# EasyEDA Pro project 通用采样.eprj, board INA240
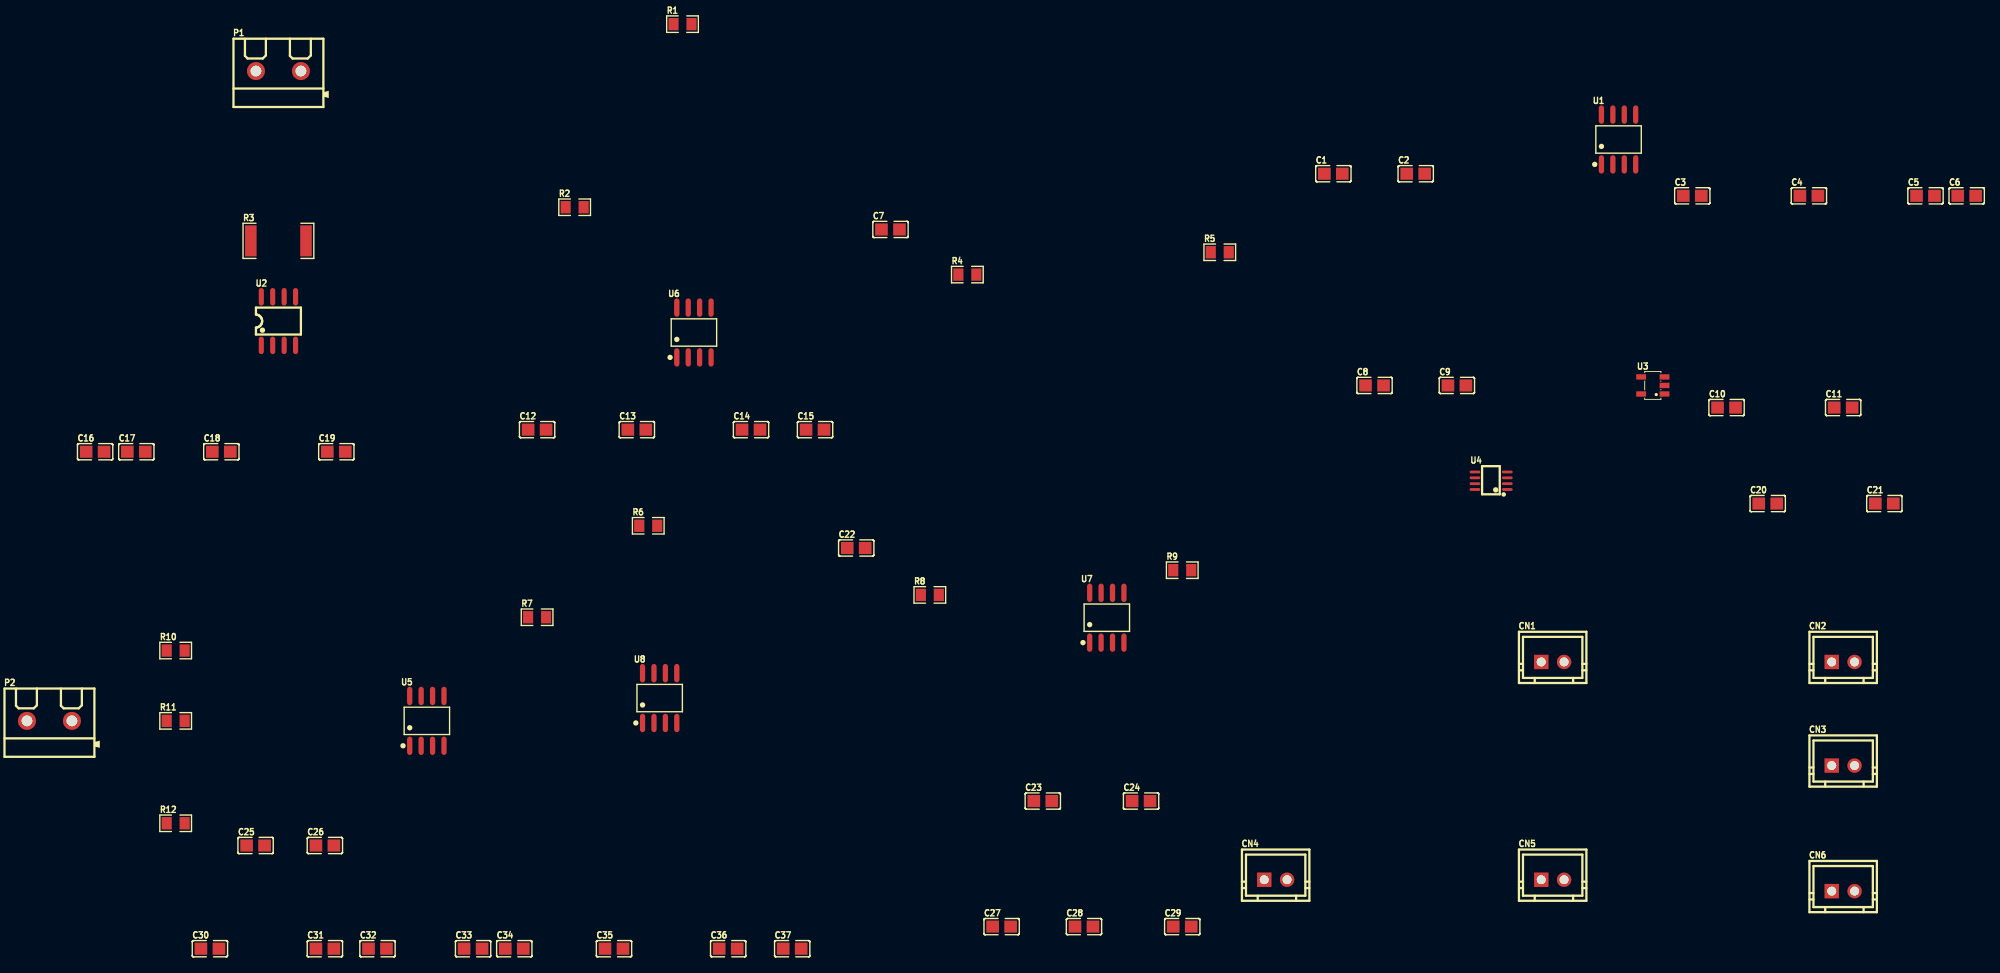
[diagram p8: board, top side]
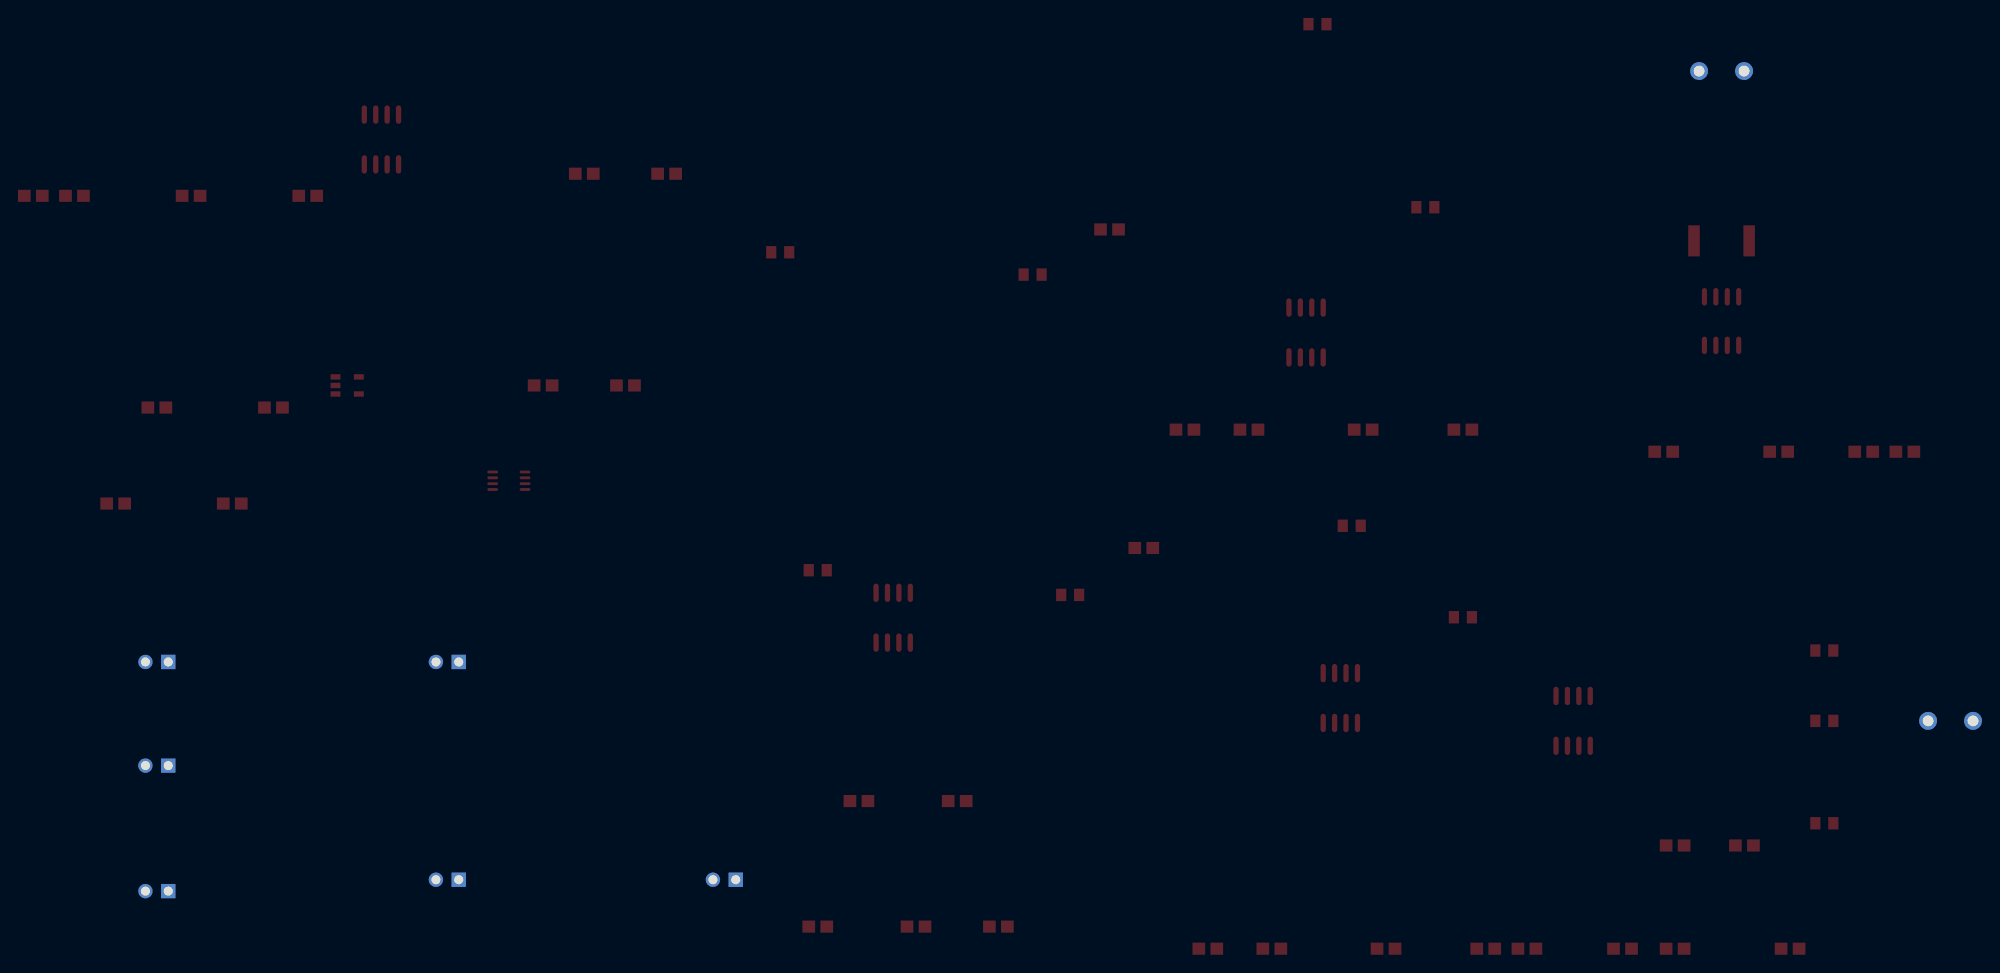
[diagram p9: board, bottom side, seen from below]

No outline. copper layers: Top Layer, Bottom Layer. Coordinates in mm from the lowest, leftmost part position.
Stack: Top Layer 0.035mm / Dielectric1 1.51mm FR4 er 4.5 / Bottom Layer 0.035mm

## Design rules (mm)
template: JLCPCB Capability(Two Layers Board)
spacing copperThickness1oz (default): track to track 0.102, other pairs 0.152 to 0.3
spacing copperThickness2oz: track to track 0.203, other pairs 0.152 to 0.3
track width copperThickness1oz (default): min 0.127, default 0.254, max 2.54
track width copperThickness2oz: min 0.203, default 0.254, max 2.54
differential pair differentialPair (default): width min 0.127, default 0.254, max 2.54; gap min 0.152, default 0.152
via viaSize (default): diameter min 0.5, default 0.61, max 10; hole min 0.3, default 0.305, max 6.3

## Placement (name value [footprint] x y rotation side)
C1  4.7uF  [C0805]  142.79 86.27 0 top
C2  100nF  [C0805]  151.95 86.27 0 top
C3  100nF  [C0805]  182.71 83.81 0 top
C4  4.7uF  [C0805]  195.68 83.81 0 top
C5  4.7uF  [C0805]  208.65 83.81 0 top
C6  4.7uF  [C0805]  213.23 83.81 0 top
C7  100nF  [C0805]  93.54 80.06 0 top
C8  1uF  [C0805]  147.37 62.7 0 top
C9  100nF  [C0805]  156.53 62.7 0 top
C10  1uF  [C0805]  186.52 60.24 0 top
C11  100nF  [C0805]  199.49 60.24 0 top
C12  100nF  [C0805]  54.24 57.78 0 top
C13  1uF  [C0805]  65.33 57.78 0 top
C14  100nF  [C0805]  78.03 57.78 0 top
C15  1uF  [C0805]  85.15 57.78 0 top
C16  100nF  [C0805]  5.08 55.32 0 top
C17  1uF  [C0805]  9.66 55.32 0 top
C18  100nF  [C0805]  19.12 55.32 0 top
C19  1uF  [C0805]  31.9 55.32 0 top
C20  100nF  [C0805]  191.1 49.55 0 top
C21  100nF  [C0805]  204.07 49.55 0 top
C22  100nF  [C0805]  89.73 44.61 0 top
C23  100nF  [C0805]  110.48 16.43 0 top
C24  1uF  [C0805]  121.41 16.43 0 top
C25  1uF  [C0805]  22.93 11.49 0 top
C26  1uF  [C0805]  30.63 11.49 0 top
C27  10uF  [C0805]  105.9 2.46 0 top
C28  10uF  [C0805]  115.06 2.46 0 top
C29  10uF  [C0805]  125.99 2.46 0 top
C30  100nF  [C0805]  17.85 0 0 top
C31  1uF  [C0805]  30.63 0 0 top
C32  100nF  [C0805]  36.48 0 0 top
C33  1uF  [C0805]  47.12 0 0 top
C34  100nF  [C0805]  51.7 0 0 top
C35  1uF  [C0805]  62.79 0 0 top
C36  100nF  [C0805]  75.49 0 0 top
C37  1uF  [C0805]  82.61 0 0 top
CN1  CON2-2.54*2P  [CONN-TH_2P-P2.54-V]  167.19 31.92 0 top
CN2  CON2-2.54*2P  [CONN-TH_2P-P2.54-V]  199.49 31.92 0 top
CN3  CON2-2.54*2P  [CONN-TH_2P-P2.54-V]  199.49 20.38 0 top
CN4  CON2-2.54*2P  [CONN-TH_2P-P2.54-V]  136.38 7.68 0 top
CN5  CON2-2.54*2P  [CONN-TH_2P-P2.54-V]  167.19 7.68 0 top
CN6  CON2-2.54*2P  [CONN-TH_2P-P2.54-V]  199.49 6.41 0 top
P1  KF301-2P接线端子  [CONN-TH_XY301V-A-5.0-2P]  25.47 97.7 0 top
P2  KF301-2P接线端子  [CONN-TH_XY301V-A-5.0-2P]  0 25.36 0 top
R1  10K  [R0805]  70.41 102.92 0 top
R2  10K  [R0805]  58.41 82.54 0 top
R3  30mΩ  [R2512]  25.47 78.79 0 top
R4  10K  [R0805]  102.09 75.04 0 top
R5  10K  [R0805]  130.16 77.52 0 top
R6  10K  [R0805]  66.6 47.08 0 top
R7  10K  [R0805]  54.24 36.9 0 top
R8  10K  [R0805]  97.91 39.38 0 top
R9  10K  [R0805]  125.99 42.13 0 top
R10  10K  [R0805]  14.04 33.19 0 top
R11  10K  [R0805]  14.04 25.36 0 top
R12  10K  [R0805]  14.04 13.96 0 top
U1  REF5025AIDR  [SOIC-8_L4.9-W3.9-P1.27-LS6.0-BL]  174.51 90.08 0 top
U2  INA240A1DR  [soic-8_l5.0-w4.0-p1.27-ls6.0-bl]  25.47 69.86 0 top
U3  TLV75533PDBVR  [SOT-23-5_L3.0-W1.7-P0.95-LS2.8-BR]  178.32 62.7 0 top
U4  SN74LVC2T45DCTR  [SM8_L3.2-W2.9-P0.65-LS4.3-BR]  160.34 52.09 0 top
U5  INA149AID  [SOIC-8_L4.9-W3.9-P1.27-LS6.0-BL]  41.97 25.36 0 top
U6  OPA2192IDR  [SOIC-8_L4.9-W3.9-P1.27-LS6.0-BL]  71.68 68.59 0 top
U7  TLV3202AIDR  [SOIC-8_L4.9-W3.9-P1.27-LS6.0-BL]  117.6 36.84 0 top
U8  OPA2192IDR  [SOIC-8_L4.9-W3.9-P1.27-LS6.0-BL]  67.87 27.9 0 top

## Footprints (pads in the part's own frame, mm; a bottom-side part is the same pattern mirrored in y, then rotated)
C0805
  rect 1.41x1.35 smd: 1(-1,0) 2(1,0)
CONN-TH_2P-P2.54-V
  rect 1.6x1.6 hole 1: 1(-1.27,0)
  round 1.6 hole 1: 2(1.27,0)
CONN-TH_XY301V-A-5.0-2P
  round 2 hole 1.2: 1(-2.5,0) 2(2.5,0)
R0805
  rect 1.133x1.377 smd: 1(-1,0) 2(1,0)
R2512
  rect 1.282x3.456 smd: 1(-3.067,0) 2(3.067,0)
SM8_L3.2-W2.9-P0.65-LS4.3-BR
  oval 1.198x0.315 smd: 1(1.799,-0.975) 2(1.799,-0.325) 3(1.799,0.325) 4(1.799,0.975) 5(-1.799,0.975) 6(-1.799,0.325) 7(-1.799,-0.325) 8(-1.799,-0.975)
SOIC-8_L4.9-W3.9-P1.27-LS6.0-BL
  oval 0.588x2.045 smd: 1(-1.905,-2.772) 2(-0.635,-2.772) 3(0.635,-2.772) 4(1.905,-2.772) 5(1.905,2.772) 6(0.635,2.772) 7(-0.635,2.772) 8(-1.905,2.772)
soic-8_l5.0-w4.0-p1.27-ls6.0-bl
  oval 0.569x1.95 smd: 1(-1.905,-2.705) 2(-0.635,-2.705) 3(0.635,-2.705) 4(1.905,-2.705) 5(1.905,2.705) 6(0.635,2.705) 7(-0.635,2.705) 8(-1.905,2.705)
SOT-23-5_L3.0-W1.7-P0.95-LS2.8-BR
  rect 1.1x0.6 smd: 1(1.3,-0.95) 2(1.3,0) 3(1.3,0.95) 4(-1.3,0.95) 5(-1.3,-0.95)

## Nets
As in the schematic.

Pads without a net: U1 1 3 5 7 8; U2 4; U3 4; U5 8
